# EAGLE design Papra v0.7 (EAGLE 9.6.2)
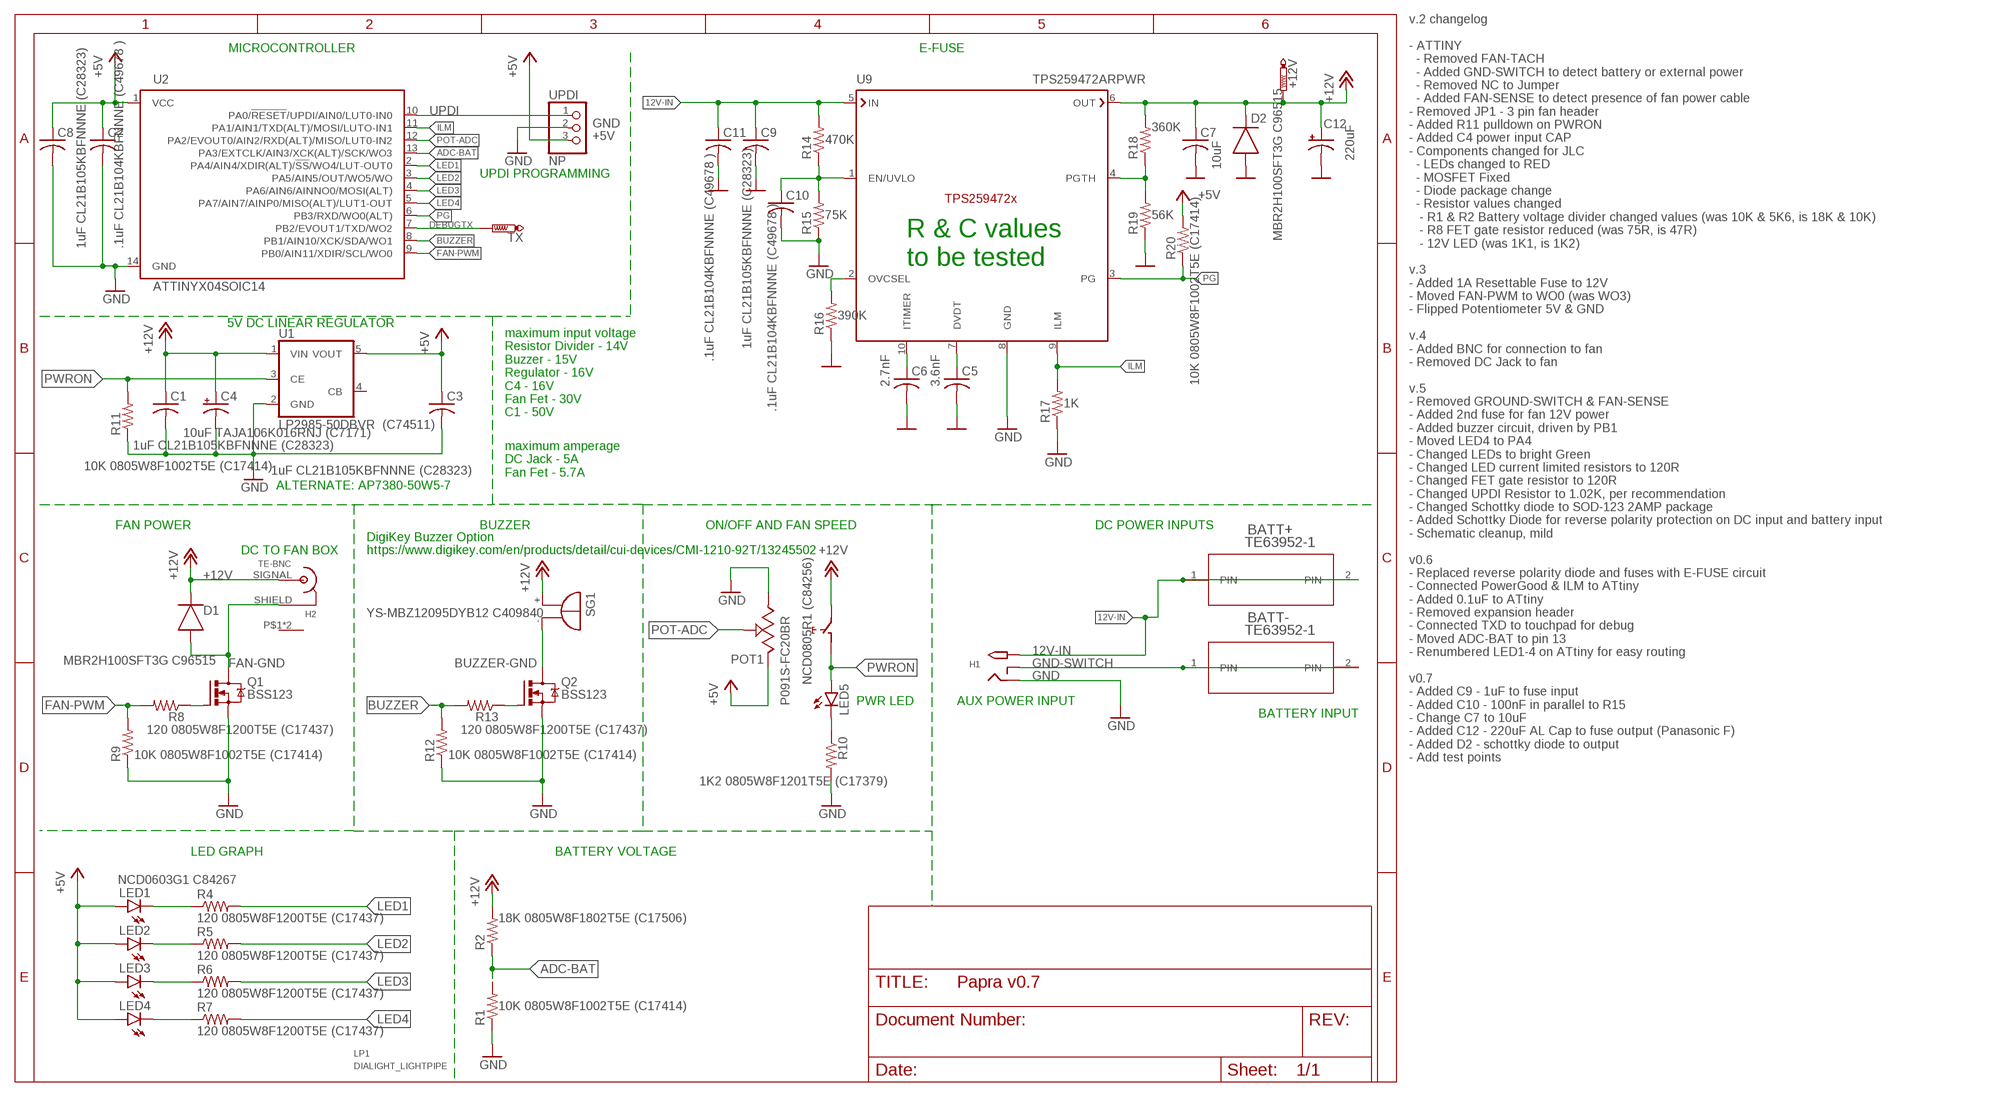
[diagram p0: schematic, sheet 1]

## Parts
+12V  PTR1B1,27  [B1,27]
BATT+  TE63952-1  [TE63952-1]
BATT-  TE63952-1  [TE63952-1]
C1  1uF CL21B105KBFNNNE (C28323)  C-USC0805  [C0805]
C2  .1uF CL21B104KBFNNNE (C49678 )  C-USC0805  [C0805]
C3  1uF CL21B105KBFNNNE (C28323)  C-USC0805  [C0805]
C4  10uF TAJA106K016RNJ (C7171)  CPOL-USA/3216-18R  [A/3216-18R]
C5  3.6nF  C-USC0805  [C0805]
C6  2.7nF  C-USC0805  [C0805]
C7  10uF  C-USC0805  [C0805]
C8  1uF CL21B105KBFNNNE (C28323)  C-USC0805  [C0805]
C9  .1uF CL21B104KBFNNNE (C49678 )  C-USC0805  [C0805]
C10  .1uF CL21B104KBFNNNE (C49678 )  C-USC0805  [C0805]
C11  1uF CL21B105KBFNNNE (C28323)  C-USC0805  [C0805]
C12  220uF  CPOL-USF  [PANASONIC_F]
D1  MBR2H100SFT3G C96515  DIODE_DO-219-AB(SOD123F)  [SODFL3718X115]
D2  MBR2H100SFT3G C96515  DIODE_DO-219-AB(SOD123F)  [SODFL3718X115]
H1  M-CUI-PJ-066A  PJ-066A  [DCJACK-PJ-066A]
H2  TE-BNC  [TE-BNC]
LED1  NCD0603G1 C84267  LEDCHIPLED_0805  [CHIPLED_0805]
LED2  NCD0603G1 C84267  LEDCHIPLED_0805  [CHIPLED_0805]
LED3  NCD0603G1 C84267  LEDCHIPLED_0805  [CHIPLED_0805]
LED4  NCD0603G1 C84267  LEDCHIPLED_0805  [CHIPLED_0805]
LED5  NCD0805R1 (C84256)  LEDCHIPLED_0805  [CHIPLED_0805]
LP1  DIALIGHT_LIGHTPIPE  [DIALIGHT_5151020F_/LEDS]
POT1  P091S-FC20BR  [P091S-FC20BR]
Q1  BSS123  NMOSFET_BSS123-SOT23  [SOT23]
Q2  BSS123  NMOSFET_BSS123-SOT23  [SOT23]
R1  10K 0805W8F1002T5E (C17414)  R-US_R0805  [R0805]
R2  18K 0805W8F1802T5E (C17506)  R-US_R0805  [R0805]
R4  120 0805W8F1200T5E (C17437)  R-US_R0805  [R0805]
R5  120 0805W8F1200T5E (C17437)  R-US_R0805  [R0805]
R6  120 0805W8F1200T5E (C17437)  R-US_R0805  [R0805]
R7  120 0805W8F1200T5E (C17437)  R-US_R0805  [R0805]
R8  120 0805W8F1200T5E (C17437)  R-US_R0805  [R0805]
R9  10K 0805W8F1002T5E (C17414)  R-US_R0805  [R0805]
R10  1K2 0805W8F1201T5E (C17379)  R-US_R0805  [R0805]
R11  10K 0805W8F1002T5E (C17414)  R-US_R0805  [R0805]
R12  10K 0805W8F1002T5E (C17414)  R-US_R0805  [R0805]
R13  120 0805W8F1200T5E (C17437)  R-US_R0805  [R0805]
R14  470K  R-US_R0805  [R0805]
R15  75K  R-US_R0805  [R0805]
R16  390K  R-US_R0805  [R0805]
R17  1K  R-US_R0805  [R0805]
R18  360K  R-US_R0805  [R0805]
R19  56K  R-US_R0805  [R0805]
R20  10K 0805W8F1002T5E (C17414)  R-US_R0805  [R0805]
SG1  YS-MBZ12095DYB12 C409840  F/TMB  [F/TMB]
TX  PTR1PAD1-13  [P1-13]
U1  LP2985-50DBVR (C74511)  TS520533  [SOT25]
U2  ATTINYX04SOIC14  [SOIC127P600X144-14]
U9  TPS259472ARPWR  [QFN45P200X200X100-16N]
UPDI  NP  PINHD-1X3  [1X03]

## Nets
12V-IN [RAIL]: BATT+.1(PIN) BATT+.2(PIN) C9.1 C11.1 H1.PWR(TIP) R14.2 U9.5(IN)
+5V [RAIL]: C2.1 C3.1 C8.1 LED1.A LED2.A LED3.A LED4.A POT1.3 R20.2 U1.5(VOUT) U2.1(VCC) UPDI.3
+12V [RAIL]: +12V.TP C1.1 C4.+ C7.1 C12.+ D1.1(C) D2.1(C) H2.SIGNAL(P1) POT1.NO R2.2 R18.2 SG1.+ U1.1(VIN) U9.6(OUT)
ADC-BAT: R1.2 R2.1 U2.13(PA3/EXTCLK/AIN3/XCK(ALT)/SCK/WO3)
BUZZER: R12.2 R13.2 U2.8(PB1/AIN10/XCK/SDA/WO1)
BUZZER-GND [RAIL]: Q2.3(D) SG1.-
DEBUGTX: TX.TP U2.7(PB2/EVOUT1/TXD/WO2)
DVDT: C5.1 U9.7(DVDT)
EN/UVLO: C10.1 R14.1 R15.2 U9.1(EN/UVLO)
FAN-GND [RAIL]: D1.2(A) H2.SHIELD(P2) Q1.3(D)
FAN-PWM: R8.2 R9.2 U2.9(PB0/AIN11/XDIR/SCL/WO0)
FETGATE: Q1.1(G) R8.1
FETGATE1: Q2.1(G) R13.1
GND: C1.2 C2.2 C3.2 C4.- C5.2 C6.2 C7.2 C8.2 C9.2 C10.2 C11.2 C12.- D2.2(A) H1.GND(RING) POT1.1 Q1.2(S) Q2.2(S) R1.1 R9.1 R10.2 R11.1 R12.1 R15.1 R16.1 R17.1 R19.1 U1.2(GND) U2.14(GND) U9.8(GND) UPDI.2
GND-SWITCH: BATT-.1(PIN) BATT-.2(PIN) H1.GNDBREAK(RING_SW)
ILM: R17.2 U2.11(PA1/AIN1/TXD(ALT)/MOSI/LUTO-IN1) U9.9(ILM)
ITIMER: C6.1 U9.10(ITIMER)
LED1: R4.2 U2.2(PA4/AIN4/XDIR(ALT)/!SS!/WO4/LUT-OUT0)
LED1-R: LED1.C R4.1
LED2: R5.2 U2.3(PA5/AIN5/OUT/WO5/WO)
LED2-R: LED2.C R5.1
LED3: R6.2 U2.4(PA6/AIN6/AINNO0/MOSI(ALT))
LED3-R: LED3.C R6.1
LED4: R7.2 U2.5(PA7/AIN7/AINP0/MISO(ALT)/LUT1-OUT)
LED4-R: LED4.C R7.1
LED5-R: LED5.C R10.1
OVCSEL: R16.2 U9.2(OVCSEL)
PG: R20.1 U2.6(PB3/RXD/WO0(ALT)) U9.3(PG)
PGTH: R18.1 R19.2 U9.4(PGTH)
POT-ADC: POT1.2 U2.12(PA2/EVOUT0/AIN2/RXD(ALT)/MISO/LUT0-IN2)
PWRON: LED5.A POT1.COM R11.2 U1.3(CE)
UPDI: U2.10(PA0/!RESET!/UPDI/AIN0/LUT0-IN0) UPDI.1
Unconnected: H2.P$1(P3) H2.P$2(P3) U1.4(CB)

## Notes on the sheet
- v.2 changelog
  
  - ATTINY 
    - Removed FAN-TACH
    - Added GND-SWITCH to detect battery or external power
    - Removed NC to Jumper
    - Added FAN-SENSE to detect presence of fan power cable
  - Removed JP1 - 3 pin fan header
  - Added R11 pulldown on PWRON
  - Added C4 power input CAP 
  - Components changed for JLC
    - LEDs changed to RED
    - MOSFET Fixed
    - Diode package change
    - Resistor values changed
     - R1 & R2 Battery voltage divider changed values (was 10K & 5K6, is 18K & 10K)
     - R8 FET gate resistor reduced (was 75R, is 47R)
     - 12V LED (was 1K1, is 1K2)
  
  v.3
  - Added 1A Resettable Fuse to 12V
  - Moved FAN-PWM to WO0 (was WO3)
  - Flipped Potentiometer 5V & GND
  
  v.4 
  - Added BNC for connection to fan
  - Removed DC Jack to fan
  
  v.5
  - Removed GROUND-SWITCH & FAN-SENSE
  - Added 2nd fuse for fan 12V power
  - Added buzzer circuit, driven by PB1
  - Moved LED4 to PA4
  - Changed LEDs to bright Green
  - Changed LED current limited resistors to 120R
  - Changed FET gate resistor to 120R
  - Changed UPDI Resistor to 1.02K, per recommendation
  - Changed Schottky diode to SOD-123 2AMP package
  - Added Schottky Diode for reverse polarity protection on DC input and battery input
  - Schematic cleanup, mild
  
  v0.6
  - Replaced reverse polarity diode and fuses with E-FUSE circuit
  - Connected PowerGood & ILM to ATtiny
  - Added 0.1uF to ATtiny
  - Removed expansion header
  - Connected TXD to touchpad for debug
  - Moved ADC-BAT to pin 13
  - Renumbered LED1-4 on ATtiny for easy routing
  
  v0.7
  - Added C9 - 1uF to fuse input
  - Added C10 - 100nF in parallel to R15
  - Change C7 to 10uF
  - Added C12 - 220uF AL Cap to fuse output (Panasonic F)
  - Added D2 - schottky diode to output
  - Add test points
- MICROCONTROLLER | E-FUSE
- UPDI PROGRAMMING
- R & C values
  to be tested
- 5V DC LINEAR REGULATOR
- maximum input voltage
  Resistor Divider - 14V
  Buzzer - 15V
  Regulator - 16V
  C4 - 16V
  Fan Fet - 30V
  C1 - 50V
- maximum amperage
  DC Jack - 5A
  Fan Fet - 5.7A
- ALTERNATE: AP7380-50W5-7
- FAN POWER | BUZZER | ON/OFF AND FAN SPEED | DC POWER INPUTS
- DC TO FAN BOX
- DigiKey Buzzer Option
  https://www.digikey.com/en/products/detail/cui-devices/CMI-1210-92T/13245502
- PWR LED | AUX POWER INPUT
- BATTERY INPUT
- LED GRAPH | BATTERY VOLTAGE

## Library data of the parts
+12V TX = testpad:PTR1: TEST PIN
BATT+ BATT- = PC-LIB:TE63952-1
C1-C3 C5-C11 = rcl:C-US: CAPACITOR, American symbol; SPICEPREFIX: C
C4 C12 = rcl:CPOL-US: POLARIZED CAPACITOR, American symbol; SPICEPREFIX: C
D1 D2 = Diode:DIODE: Diode Rectifier - Generic; CATEGORY: Diode; SUB-CATEGORY: Rectifier; VALUE: DIODE
H1 = PC-LIB:PJ-066A
H2 = PC-LIB:TE-BNC: https://www.te.com/usa-en/product-1-1478032-0.html
LED1-LED5 = led:LED: LED OSRAM: - CHIPLED LG R971, LG N971, LY N971, LG Q971, LY Q971, LO R971, LY R971 LH N974, LH R974 LS Q976, LO Q976, LY Q976 LO Q996 - Hyper CHIPLED LW Q18S LB Q993, LB Q99A, LB R99A - SideLED LS A670, LO A670, LY A670, LG A670, LP A670 LB A673, LV A673, LT A673, LW A673 LH A674 LY A675 LS A676, LA A676, LO A676, LY A676, LW A676 LS A679, LY A679, LG A679 - Hyper Micro SIDELED® LS Y876, LA Y876, LO Y876, LY Y876 LT Y87S - SmartLED LW L88C, LW L88S LB L89C, LB L89S, LG L890 LS L89K, LO L89K, LY L89K LS L896, LA L896, LO L896, LY L896 - TOPLED LS T670, LO T670, LY T670, LG T670, LP T670 LSG T670, LSP T670, LSY T670, LOP T670, LYG T670 LG T671, LOG T671, LSG T671 LB T673, LV T673, LT T673, LW T673 LH T674 LS T676, LA T676, LO T676, LY T676, LB T676, LH T676, LSB T676, LW T676 LB T67C, LV T67C, LT T67C, LS T67K, LO T67K, LY T67K, LW E67C LS E67B, LA E67B, LO E67B, LY E67B, LB E67C, LV E67C, LT E67C LW T67C LS T679, LY T679, LG T679 LS T770, LO T770, LY T770, LG T770, LP T770 LB T773, LV T773, LT T773, LW T773 LH T774 LS E675, LA E675, LY E675, LS T675 LS T776, LA T776, LO T776, LY T776, LB T776 LHGB T686 LT T68C, LB T68C - Hyper Mini TOPLED® LB M676 - Mini TOPLED Santana® LG M470 LS M47K, LO M47K, LY M47K Source: http://www.osram.convergy.de LUXEON: - LUMILED® LXK2-PW12-R00, LXK2-PW12-S00, LXK2-PW14-U00, LXK2-PW14-V00 LXK2-PM12-R00, LXK2-PM12-S00, LXK2-PM14-U00 LXK2-PE12-Q00, LXK2-PE12-R00, LXK2-PE12-S00, LXK2-PE14-T00, LXK2-PE14-U00 LXK2-PB12-K00, LXK2-PB12-L00, LXK2-PB12-M00, LXK2-PB14-N00, LXK2-PB14-P00, LXK2-PB14-Q00 LXK2-PR12-L00, LXK2-PR12-M00, LXK2-PR14-Q00, LXK2-PR14-R00 LXK2-PD12-Q00, LXK2-PD12-R00, LXK2-PD12-S00 LXK2-PH12-R00, LXK2-PH12-S00 LXK2-PL12-P00, LXK2-PL12-Q00, LXK2-PL12-R00 Source: www.luxeon.com KINGBRIGHT: KA-3528ASYC Source: www.kingbright.com
LP1 = PC-LIB:DIALIGHT_LIGHTPIPE: DIALIGHT QUAD LIGHTPIPE 515-1020 WITH 0805LEDS
POT1 = PC-LIB:P091S-FC20BR: TT P091S-FC20BR10K
Q1 Q2 = Transistor:NMOSFET_: N-Channel MOSFET - Popular parts; CATEGORY: Transistor; DESCRIPTION: MOSFET N-CH 100V 0.17A SOT-23; DRAIN_CURRENT: 170mA; MANUFACTURER: ON Semiconductor; MPN: BSS123L; OPERATING_TEMP: -55°C ~ 150°C; PART_STATUS: Active; ROHS_COMPLIANT: Yes; SUB-CATEGORY: MOSFET; THERMALLOSS: 360mW; TYPE: N-Channel
R1 R2 R4-R20 = rcl:R-US_: RESISTOR, American symbol; SPICEPREFIX: R
SG1 = buzzer:F/TMB: BUZZER Source: Buerklin; OC_FARNELL: unknown; OC_NEWARK: unknown
U1 = v-reg:TS5205: 150mA Low Noise LDO Voltage Regulator with Enable TSC [Taiwan Semiconductor Company, Ltd] Source: http://www.taiwansemi.com .. 5205_0409c.pdf
U2 = PC-LIB:ATTINYX04
U9 = TI e-Fuse:TPS259472ARPWR
UPDI = adafruit:PINHD-1X3: PIN HEADER

## Net classes
0 default: width 0.152 mm
1 RAIL: width 0.229 mm

## Board
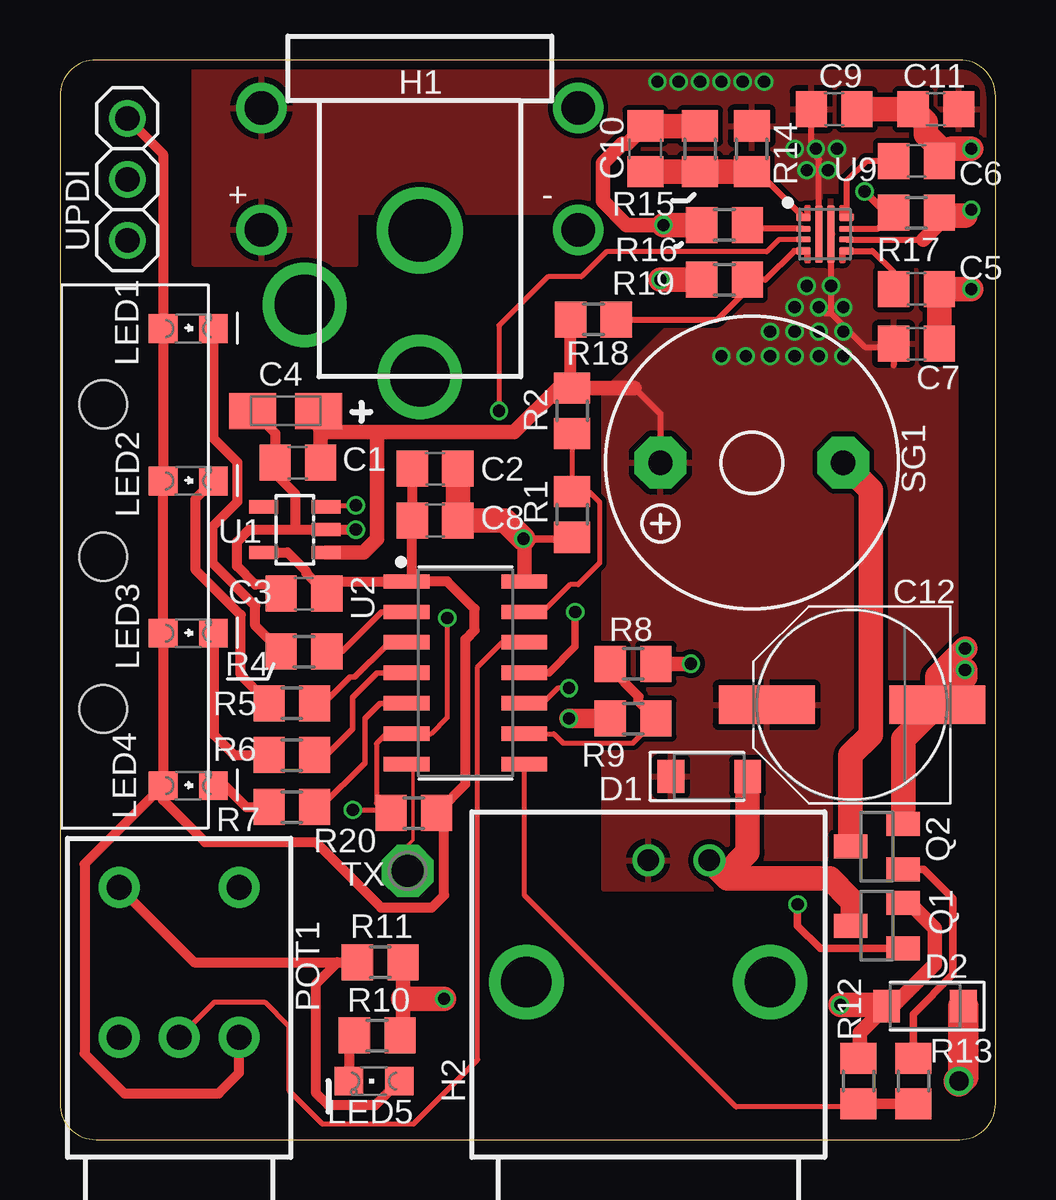
[diagram p1: board, top side]
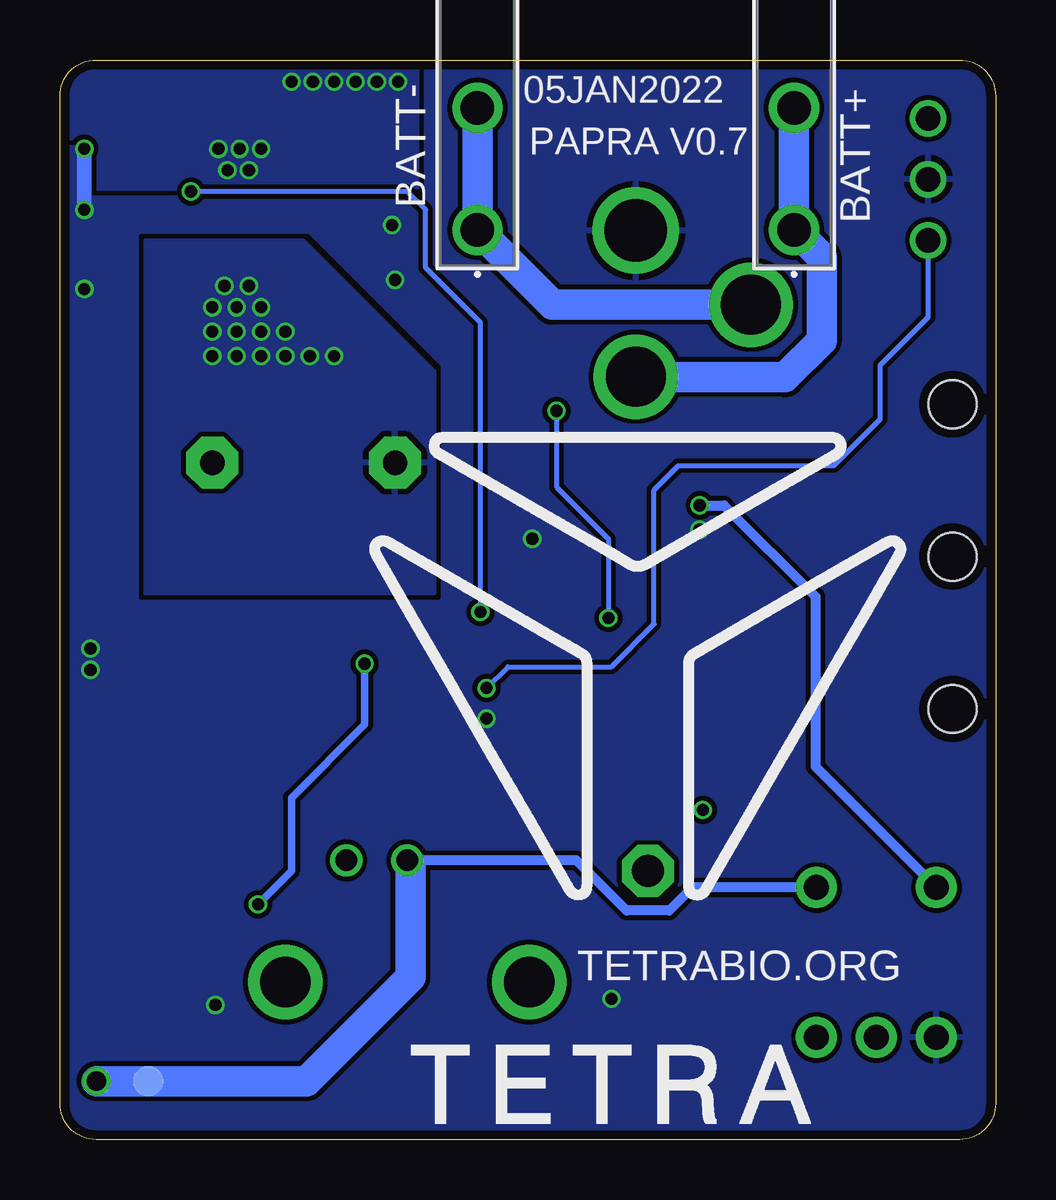
[diagram p2: board, bottom side, seen from below]

Size 39 x 45 mm. Coordinates in mm from the lower left corner, seen from the top.
Outline: 1.5,0 37.5,0 arc90 39,1.5 39,43.5 arc90 37.5,45 1.5,45 arc90 0,43.5 0,1.5 arc90 1.5,0
Copper layers (1*16): Top 0.035559375mm / dielectric 1.6mm / Bottom 0.035559375mm
Design rules "oshpark-2layer": minimum track width 6mil, minimum drill 10mil, track to track 6mil, track to pad 6mil, pad to pad 6mil, via to via 6mil, smd to smd 6mil, copper to edge 15mil, drill to drill 6mil, minimum pad ring 5mil, minimum via ring 5mil, stop-mask expansion 2.5mil, vias tented up to drill 0mil, thermal gap 10mil

### Footprints (pad centres in the part's own frame; a part is rotated, then mirrored left to right if it is on the bottom)
B1,27 = smd 1.27 x 1.27: TP 0,0
TE63952-1 = drill 1.397 pad 1.905: 1 -2.54,0; 2 2.54,0
C0805 = smd 1.3 x 1.5: 1 -0.95,0; 2 0.95,0
A/3216-18R = smd 1.95 x 1.5: + 1.375,0; - -1.375,0
PANASONIC_F = smd 4 x 1.6: + 3.55,0; - -3.55,0
SODFL3718X115 = smd 1.115 x 1.361: 1 -1.6,0; 2 1.6,0
DCJACK-PJ-066A = drill 2.6: GND 0,8.1 | drill 2.5: GNDBREAK 4.8,11.2; PWR 0,14.2
TE-BNC = drill 2.1: P$1 -7.3,5.08; P$2 -7.3,-5.08 | drill 0.89: SHIELD -12.38,2.54; SIGNAL -12.38,0
CHIPLED_0805 = smd 1.2 x 1.2: A 0,-1.05; C 0,1.05
DIALIGHT_5151020F_/LEDS = hole 2: 0,0; 6.35,0; -6.35,0
P091S-FC20BR = drill 1.05 pad 1.7: 1 -5,-2.5; 2 -5,0; 3 -5,2.5; COM -11.25,-2.5; NO -11.25,2.5
SOT23 = smd 1 x 1.4: 1 -0.95,-1.1; 2 0.95,-1.1; 3 0,1.1
R0805 = smd 1.3 x 1.5: 1 -0.95,0; 2 0.95,0
F/TMB = drill 1.016 pad 2.159 octagon: + 3.81,0; - -3.81,0
P1-13 = drill 1.321 pad 2.159 octagon: TP 0,0
SOT25 = smd 0.55 x 1.2: 1 -0.95,-1.3; 2 0,-1.3; 3 0.95,-1.3; 4 0.95,1.3; 5 -0.95,1.3
SOIC127P600X144-14 = smd 1.901 x 0.599: 1 -2.455,3.81; 2 -2.455,2.54; 3 -2.455,1.27; 4 -2.455,0; 5 -2.455,-1.27; 6 -2.455,-2.54; 7 -2.455,-3.81; 8 2.455,-3.81; 9 2.455,-2.54; 10 2.455,-1.27; 11 2.455,0; 12 2.455,1.27; 13 2.455,2.54; 14 2.455,3.81
QFN45P200X200X100-16N = smd 0.6 x 0.3: 1 -0.9,0.7; 4 -0.9,-0.7; 7 0.9,-0.7; 10 0.9,0.7 | smd 0.6 x 0.25: 2 -0.9,0.225; 3 -0.9,-0.225; 8 0.9,-0.225; 9 0.9,0.225 | smd 0.3 x 2.4: 5 -0.25,0; 6 0.25,0
1X03 = drill 1.016: 1 -2.54,0; 2 0,0; 3 2.54,0

### Placement (x,y rotation side)
+12V  35.32,2.43 0 bottom
BATT+  8.4,40.46 90 bottom
BATT-  21.6,40.46 90 bottom
C1  9.92,28.21 180 top
C2  15.63,27.96 0 top
C3  10.17,22.75 180 top
C4  9.41,30.37 0 top
C5  35.7,35.45 0 top
C6  35.7,40.79 0 top
C7  35.7,33.17 0 top
C8  15.63,25.8 0 top
C9  32.27,42.95 0 top
C10  24.4,41.3 90 top
C11  36.51,42.95 180 top
C12  33.02,18.12 180 top
D1  27.06,15.13 0 top
D2  36.06,5.56 180 top
H1  15,46 180 top
H2  24.52,-0.74 270 top
LED1  5.35,33.8 270 top
LED2  5.35,27.45 270 top
LED3  5.35,21.1 270 top
LED4  5.35,14.75 270 top
LED5  13.1,2.43 90 top
LP1  1.8,24.3 270 top
POT1  4.97,-0.74 270 top
Q1  34.05,8.91 90 top
Q2  34.05,12.21 90 top
R1  21.35,26.06 90 top
R2  21.35,30.37 90 top
R4  10.17,20.34 0 top
R5  9.67,18.18 0 top
R6  9.67,16.02 0 top
R7  9.67,13.86 0 top
R8  23.89,19.83 180 top
R9  23.89,17.55 0 top
R10  13.22,4.34 0 top
R11  13.35,7.39 180 top
R12  33.29,2.43 270 top
R13  35.57,2.43 270 top
R14  28.84,41.3 90 top
R15  26.68,41.3 270 top
R16  27.7,38.12 0 top
R17  35.7,38.63 180 top
R18  22.24,34.18 180 top
R19  27.7,35.84 0 top
R20  14.75,13.61 0 top
SG1  28.84,28.21 180 top
TX  14.49,11.2 0 top
U1  9.79,25.42 90 top
U2  16.91,19.45 0 top
U9  31.89,37.74 0 top
UPDI  2.81,40.03 90 top

### Tracks (layer width: path | path; a pad name or v marks a point on that pad's centre or on a via)
12V-IN  (via drill 0.51)
  Top 0.254: C9.1 31.32,41.17 31.64,40.85 U9.5
  Bottom 1.27: BATT+.2 BATT+.1 7.25,36.77 7.25,33.3 8.78,31.77 14.98,31.77 H1.PWR
  other vias: 24.91,44.09 25.8,44.09 26.68,44.09 27.57,44.09 28.46,44.09 29.35,44.09 30.62,41.3 31.51,41.3 32.4,41.3 31.13,40.41 32.02,40.41
  pour Bottom (isolate 0.203, rank 2): 24.14,39.64 39.25,39.64 39.25,45.23 24.14,45.23
  pour Top (isolate 0.203, rank 2): 5.6,45.23 39.26,45.23 39.26,38.63 12.33,38.63 12.33,36.47 5.6,36.47
+5V
  Top 0.406: 14.56,23.37 U2.1 11.63,23.26 C3.1 10.28,23.6 10.28,23.67 9.48,24.47 U1.5 | 14.56,23.37 14.69,23.5 C8.1 C2.1 | LED4.A LED3.A LED2.A LED1.A 4.3,41.08 UPDI.3 | LED4.A 1.03,11.48 1.03,3.58 2.68,1.93 6.62,1.93 7.47,2.77 POT1.3 | R20.2 15.79,13.71 | 15.79,13.71 16.91,14.82 16.91,20.85 17.29,21.23 17.29,22.12 16.14,23.26 14.67,23.26 14.56,23.37 | LED4.A 4.3,14.15 6.05,12.4 10.65,12.4 13.38,9.67 15.51,9.67 16.02,10.18 16.02,13.48 15.79,13.71
+12V  (via drill 0.51, 0.8)
  Top 0.254: 32.14,34.44 33.54,33.04 34.62,33.04 C7.1 34.75,32.27 | U9.6 32.14,34.44 | 31.89,34.44 32.14,34.44 | SG1.+ 25.03,30.25 23.96,31.32
  Top 0.406: C4.+ 10.87,30.29 | 20.78,31.32 R2.2
  Top 0.508: R2.2 21.29,31.38 R18.2
  Top 0.61: R2.2 23.96,31.32 | 10.87,30.29 C1.1 | C4.+ 10.79,29.74 11.04,29.48 13.22,29.48 | 13.22,29.48 18.94,29.48 20.78,31.32 | U1.1 12.65,24.47 13.22,25.04 13.22,29.48
  Top 1.27: D2.1 37.66,2.61 v37.48,2.43
  Bottom 0.406: POT1.NO 12.64,10.51 13.6,9.55 15.38,9.55 17.47,11.64 H2.SIGNAL
  Bottom 1.27: H2.SIGNAL 24.4,11.51 24.4,6.75 28.72,2.43 v37.48,2.43 +12V.TP
  other vias: 31.13,35.58 32.14,35.58 30.62,34.69 31.64,34.69 32.65,34.69 30.62,33.68 31.64,33.68 32.65,33.68 32.65,32.66 31.64,32.66 30.62,32.66 29.61,32.66 28.59,32.66 29.61,33.68 27.57,32.66
  pour Top (isolate 0.203): 30.62,39.14 32.78,39.14 37.35,34.56 37.35,10.44 22.67,10.44 22.67,31.19
  pour Bottom (isolate 0.203): 23.38,22.75 35.45,22.75 35.45,37.49 28.84,37.49 23.38,32.02
ADC-BAT
  Top 0.203: R2.1 R1.2 22.05,27.01 22.49,26.56 22.49,24.02 21.6,23.14 21.27,23.14 20.12,21.99 U2.13
BUZZER
  Top 0.203: R13.2 35.45,1.36 28.18,1.36 19.36,10.18 U2.8
  Top 0.406: R13.2 R12.2
BUZZER-GND
  Top 1.016: SG1.- 33.8,27.07 33.8,16.87 32.95,16.02 Q2.3
DEBUGTX
  Top 0.152: TX.TP 14.49,12.26 14.72,12.49 14.72,15.37 U2.7
DVDT
  Top 0.254: U9.7 33.86,37.04 34.75,36.15 C5.1
EN/UVLO
  Top 0.254: U9.1 29.09,40.35 R14.1
  Top 1.016: C10.1 R15.2 R14.1
FAN-GND
  Top 0.813: Q1.3 32.95,10.01
  Top 1.016: 32.95,10.01 32.08,10.88 27.83,10.88 H2.SHIELD 27.7,11 27.71,11 28.66,11.96 D1.2
FAN-PWM
  Top 0.203: U2.9 20.59,16.91 20.97,16.53 23.89,16.53 24.84,17.48 R9.2
  Top 0.406: R9.2 24.12,18.26 24.12,18.46 22.94,19.65 R8.2
FETGATE  (via drill 0.51)
  Top 0.305: Q1.1 31.7,7.96 30.75,8.91 v30.75,9.8
  Top 0.61: R8.1 v26.3,19.83
  Bottom 0.305: v26.3,19.83 26.3,17.29 29.35,14.24 29.35,11.2 v30.75,9.8
FETGATE1
  Top 0.305: R13.1 35.57,5.23 37.23,6.88 37.23,10.05 36.02,11.26 Q2.1
GND  (via drill 0.51)
  Top 0.203: C5.2 36.72,35.45 | 19.32,23.3 U2.14
  Top 0.254: U9.8 35.98,37.52 | 36.65,38.18 36.65,38.5
  Top 0.305: R1.1 21.28,25.04 v19.32,25.04
  Top 0.406: C4.- 8.97,29.44 C1.2 8.97,27.76 9.79,26.94 9.79,25.42 | R10.2 14.3,4.47 | C3.2 8.84,23.14 8.14,23.14 7.38,23.9 7.38,24.91 7.89,25.42 9.79,25.42 | 9.79,25.42 U1.2 v12.33,25.42
  Top 0.61: 14.3,4.47 14.3,5.86 R11.1 | 35.98,37.52 36.65,38.18 | R17.1 36.65,38.5 | 33.34,3.43 33.34,4.44 D2.2 34.71,5.56 36.46,7.31 36.46,8.8 35.4,9.86 Q1.2 | v37.99,38.76 37.73,38.5 | C6.2 37.16,41.3 | U2.14 19.36,25 v19.32,25.04 | C10.2 23.66,41.5 23.44,41.5 22.63,40.7 22.63,39.11 23.62,38.12 v25.16,38.12
  Top 0.813: v21.22,17.55 R9.1 | R12.1 33.34,3.43
  Top 1.016: C10.2 R15.1 | C9.2 C11.2 36.1,42.41 36.1,41.9 36.65,41.35 C6.2 | R19.1 v25.03,35.84 | v25.16,38.12 R16.1 | 36.72,35.45 v37.99,35.45 | C5.2 C7.2 | C12.- 35.15,16.7 Q2.2 | C12.- 37.73,19.29 v37.73,19.58 | v37.73,20.47 36.57,19.3 C12.- | 37.73,38.5 36.65,38.5 | 37.16,41.3 v37.99,41.3 | C2.2 C8.2 18.56,25.8 v19.32,25.04 | v16.02,5.86 14.3,5.86 | v32.53,5.61 34.41,5.61 D2.2
  Bottom 0.61: v37.99,41.3 v37.99,38.76
  pour Bottom (isolate 0.203, rank 3): 40.02,50.31 -1,50.31 -1,-1.5 40.02,-1.5
GND-SWITCH
  Bottom 1.27: BATT-.2 BATT-.1 18.48,34.8 H1.GNDBREAK
ILM  (via drill 0.51)
  Top 0.254: U9.9 34.09,37.97 34.65,38.53 R17.2
  Top 0.305: v33.54,39.52 34.53,38.53 34.65,38.53 | U2.11 20.38,19.45 21.48,20.55 v21.48,21.99
  Bottom 0.203: v21.48,21.99 21.48,34.06 23.76,36.34 23.76,38.76 24.52,39.52 v33.54,39.52
ITIMER
  Top 0.254: C6.1 33.61,40.79 32.79,39.97 U9.10
LED1
  Top 0.229: R4.2 11.76,20.34 13.41,21.99 U2.2
LED1-R
  Top 0.406: R4.1 8.14,21.42 8.14,22.25 6.36,24.02 6.36,25.55 7.4,26.59 7.4,28.22 6.4,29.23 LED1.C
LED2
  Top 0.229: R5.2 11,18.18 12.09,19.27 12.29,19.27 13.61,20.59 14.32,20.59 U2.3
LED2-R
  Top 0.406: LED2.C 5.64,26.69 5.64,23.77 7.53,21.87 7.53,19.37 R5.1
LED3
  Top 0.229: R6.2 11.12,16.02 12.21,17.11 12.21,18.44 13.22,19.45 U2.4
LED3-R
  Top 0.406: LED3.C 6.4,16.88 7.25,16.02 R6.1
LED4
  Top 0.229: R7.2 10.87,13.86 12.71,15.71 12.71,17.55 13.35,18.18 U2.5
LED4-R
  Top 0.406: LED4.C 6.87,14.75 7.76,13.86 R7.1
LED5-R
  Top 0.406: R10.1 12.04,4.11 LED5.C
OVCSEL
  Top 0.254: U9.2 28.81,37.97 R16.2
PG  (via drill 0.51)
  Top 0.203: U9.3 29.98,37.52 29.47,37.01 22.78,37.01 21.73,35.96 20.33,35.96 18.3,33.93 v18.3,30.37 | 13.48,13.74 13.19,14.02 13.19,16.5 13.6,16.91 U2.6 15.47,16.91 16.14,17.59 v16.14,21.74 | R20.1 13.6,13.61 13.48,13.74 | v12.21,13.74 13.48,13.74
  Bottom 0.203: v18.3,30.37 18.3,27.2 16.14,25.04 v16.14,21.74
PGTH
  Top 0.254: U9.4 30.61,37.04 29.41,35.84 R19.2 28.65,35.43 27.4,34.18 R18.1
POT-ADC
  Top 0.203: POT1.2 6.44,5.74 8.52,5.74 9.54,4.72 9.54,2.05 10.94,0.66 14.75,0.66 17.41,3.32 17.41,19.71 18.43,20.72 U2.12
PWRON  (via drill 0.51)
  Top 0.203: U1.3 11.16,26.44 v12.33,26.44
  Top 0.406: LED5.A 13.13,1.42 11.19,1.42 10.68,1.93 10.68,6.5 11.57,7.39 R11.2 5.59,7.39 POT1.COM
  Bottom 0.406: POT1.COM 7.51,15.55 7.51,22.63 11.32,26.44 v12.33,26.44
UPDI  (via drill 0.51)
  Top 0.203: v21.22,18.82 20.76,18.82 20.12,18.18 U2.10
  Bottom 0.203: v21.22,18.82 20.33,19.71 16.02,19.71 14.24,21.48 14.24,27.07 13.22,28.09 6.74,28.09 4.81,30.03 4.81,32.28 2.81,34.28 UPDI.1

### Text on the board
bPlace: 05JAN2022 | PAPRA V0.7 | TETRABIO.ORG
tNames: + | -
Document: v.2 changelog / / - BATTERY Tabs swapped (polarity, same position) / - SMT Components Moved, won't affect mechanical / - D1 package changed (was SMB, is SMA) / / v.3 changelog (see schematic for signal changes) / / - Added mounting hole / - Added fuse, moved SMT components to fit / - Adjustments for JLC DRU, pad override was 40%, reduced to 25% / - Silk cleanup / - Changed Battery Tab package to round pads (was square) / / v.4 / - Board is 2mm wider on right side / - DC power out is now BNC / / v.5 / - Added buzzer / / v.6 / - See schematic changes
200bmp: C:/Users/pc/Downloads/Tetra Logo Package/tetra.bmp